# Altium schematic sheet Voltage Regulators.SchDoc
size A4; SheetNumber: 13; SheetTotal: 13; SPICEModelCacheFXTNRSHI: <root> / <DocumentId>FXTNRSHI</DocumentId> / <CacheFrame Number="0"> / <Model Name="1206_885012108012_47uf" Kind="CKT"> / <Text>******* / .subckt 1206_885012108012_47uF 1 2 / Rser 1 3 0.0027428064885 / Lser 2 4 0.0000000008 / C1 3 4 0.000047 / Rpar 3 4 1000000 / .ends 1206_885012108012_47uF</Text> / </Model> / <Model Name="1210_885012209074_22uf" Kind="CKT"> / <Text>******* / .subckt 1210_885012209074_22uF 1 2 / Rser 1 3 0.0043 / Lser 2 4 0.000000001 / C1 3 4 0.000022 / Rpar 3 4 5000000 / .ends 1210_885012209074_22uF</Text> / </Model> / </CacheFrame> / </root>
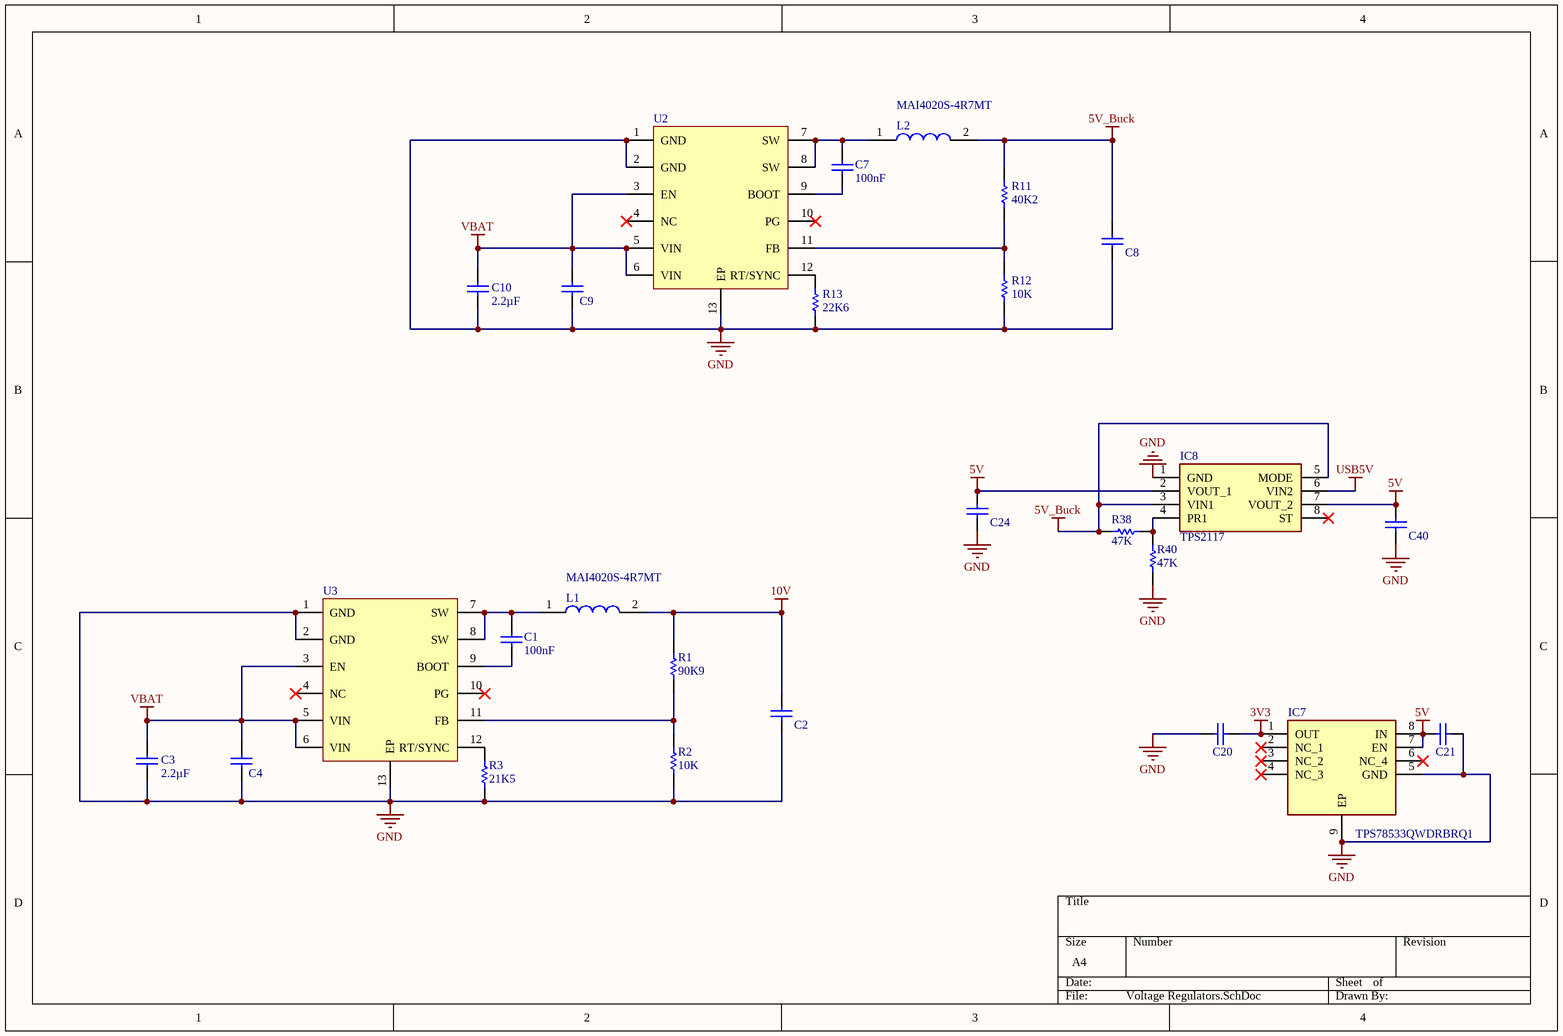
[diagram p0: Voltage Regulators.SchDoc]

## Parts
C1  100nF  [0402 cap]
C2  22µF  [WCAP-CSGP_1210_L3.2W2.5H2.5]  (value not drawn)
C3  2.2µF  [WCAP-CSGP_1206_L3.2W1.6H1.6]
C4  100nF  [WCAP-CSGP_0603_L1.6W0.8H0.8_Reflow]  (value not drawn)
C7  100nF  [0402 cap]
C8  47µF  [WCAP-CSGP_1206_L3.2W1.6H1.6]  (value not drawn)
C9  100nF  [WCAP-CSGP_0603_L1.6W0.8H0.8_Reflow]  (value not drawn)
C10  2.2µF  [WCAP-CSGP_1206_L3.2W1.6H1.6]
C20  1µF  [WCAP-CSGP_0603_L1.6W0.8H0.8_Reflow]  (value not drawn)
C21  1µF  [WCAP-CSGP_0603_L1.6W0.8H0.8_Reflow]  (value not drawn)
C24  1µF  [WCAP-CSGP_0603_L1.6W0.8H0.8_Reflow]  (value not drawn)
C40  1µF  [WCAP-CSGP_0603_L1.6W0.8H0.8_Reflow]  (value not drawn)
IC7  TPS78533QWDRBRQ1  [SON65P300X300X100-9N-D]
IC8  TPS2117  [SOTFL50P160X60-8N]
L1  MAI4020S-4R7MT  [MAI4020S-4R7MT]
L2  MAI4020S-4R7MT  [MAI4020S-4R7MT]
R1  90K9  [0402 resistor]
R2  10K  [0402 resistor]
R3  21K5  [0402 resistor]
R11  40K2  [RESC0603(1608)_N]
R12  10K  [RESC0603(1608)_N]
R13  22K6  [RESC0603(1608)_N]
R38  47K  [0402 resistor]
R40  47K  [0402 resistor]
U2  2.5A Step Down QFN synchronous  [LMR38025]  (value not drawn)
U3  2.5A Step Down QFN synchronous  [LMR38025]  (value not drawn)

## Nets
3V3: C20.2 IC7.1(OUT)
5V: C21.1 C24.2 C40.2 IC7.7(EN) IC7.8(IN) IC8.2(VOUT_1) IC8.7(VOUT_2)
5V_Buck: C8.2 IC8.3(VIN1) IC8.5(MODE) L2.2 R11.2 R38.1
10V: C2.2 L1.2 R1.2
GND: C2.1 C3.1 C4.1 C8.1 C9.1 C10.1 C20.1 C21.2 C24.1 C40.1 IC7.5(GND) IC7.9(EP) IC8.1(GND) R2.1 R3.1 R12.1 R13.1 R40.1 U2.1(GND) U2.2(GND) U2.13(EP) U3.1(GND) U3.2(GND) U3.13(EP)
USB5V: IC8.6(VIN2)
VBAT: C3.2 C4.2 C9.2 C10.2 U2.3(EN) U2.5(VIN) U2.6(VIN) U3.3(EN) U3.5(VIN) U3.6(VIN)
NetC1_1: C1.1 U3.9(BOOT)
NetC1_2: C1.2 L1.1 U3.7(SW) U3.8(SW)
NetC7_1: C7.1 U2.9(BOOT)
NetC7_2: C7.2 L2.1 U2.7(SW) U2.8(SW)
NetIC8_4: IC8.4(PR1) R38.2 R40.2
NetR1_1: R1.1 R2.2 U3.11(FB)
NetR3_2: R3.2 U3.12(RT/SYNC)
NetR11_1: R11.1 R12.2 U2.11(FB)
NetR13_2: R13.2 U2.12(RT/SYNC)

Not connected (* = marked no-connect by the designer): IC7 2(NC_1)* 3(NC_2)* 4(NC_3)* 6(NC_4)*; IC8 8(ST)*; U2 4(NC)* 10(PG)*; U3 4(NC)* 10(PG)*

## Library data of the parts
C1 C7 = Capacitor 0402 100nF: Value: 100nF
C2 = 885012209074: WCAP-CSGP Multilayer Ceramic Chip Capacitor, General Purpose, size 1210, X7R, 22µF, 25VDC; Manufacturer: Wurth Elektronik; Case/Size Code: 1210; Capacitance Tolerance: +/10%; Dissipation Factor: 10%; Insulation Resistance: 0.005GΩ; Rated Voltage (DC): 25V; Technical Reference: X7R1210226K025DFCT10000; Manufacturer Part Number: 885012209074; Category: Multilayer Ceramic Chip Capacitors; Match Code: WCAP-CSGP; ComponentLink1Description: Website Link; ComponentLink1URL: https://www.we-online.com/redexpert/article/885012209074?ad; ComponentLink2Description: Datasheet Link; ComponentLink2URL: https://www.we-online.com/redexpert/spec/885012209074?ad; Mount: Surface Mount; Operating Temperature Max: 125°C; Operating Temperature Min: -55°C; Packaging: Tape and Reel; Length: 3.2mm; Width: 2.5mm; Height: 2.5mm; Capacitance: 22µF; Ceramic Type: X7R
C3 C10 = 885012208124: WCAP-CSGP Multilayer Ceramic Chip Capacitor, General Purpose, size 1206, X7R, 2.2µF, 100VDC; Manufacturer: Wurth Elektronik; Case/Size Code: 1206; Capacitance Tolerance: +/-10%; Dissipation Factor: 5%; Insulation Resistance: 0.05GΩ; Rated Voltage (DC): 100V; Technical Reference: X7R1206225K100DFCT10000; Manufacturer Part Number: 885012208124; Category: Multilayer Ceramic Chip Capacitors; Match Code: WCAP-CSGP; ComponentLink1Description: Website Link; ComponentLink1URL: https://www.we-online.com/redexpert/article/885012208124?ad; ComponentLink2Description: Datasheet Link; ComponentLink2URL: https://www.we-online.com/redexpert/spec/885012208124?ad; Mount: Surface Mount; Operating Temperature Max: 125°C; Operating Temperature Min: -55°C; Packaging: Tape and Reel; Length: 3.2mm; Width: 1.6mm; Height: 1.6mm; Capacitance: 2.2µF; Ceramic Type: X7R
C4 C9 = 885012206095: WCAP-CSGP Multilayer Ceramic Chip Capacitor, General Purpose, size 0603, X7R, 100nF, 50VDC; Manufacturer: Wurth Elektronik; Case/Size Code: 0603; Capacitance Tolerance: +/-10%; Dissipation Factor: 3%; Insulation Resistance: 5GΩ; Rated Voltage (DC): 50V; Technical Reference: X7R0603104K050DFCT10000; Manufacturer Part Number: 885012206095; Category: Multilayer Ceramic Chip Capacitors; Match Code: WCAP-CSGP; ComponentLink1Description: Website Link; ComponentLink1URL: https://www.we-online.com/redexpert/article/885012206095?ad; ComponentLink2Description: Datasheet Link; ComponentLink2URL: https://www.we-online.com/redexpert/spec/885012206095?ad; Mount: Surface Mount; Operating Temperature Max: 125°C; Operating Temperature Min: -55°C; Packaging: Tape and Reel; Length: 1.6mm; Width: 0.8mm; Height: 0.8mm; Capacitance: 100nF; Ceramic Type: X7R
C8 = 885012108012: WCAP-CSGP Multilayer Ceramic Chip Capacitor, General Purpose, size 1206, X5R, 47µF, 10VDC; Manufacturer: Wurth Elektronik; Case/Size Code: 1206; Capacitance Tolerance: +/-20%; Dissipation Factor: 10%; Insulation Resistance: 0.002GΩ; Rated Voltage (DC): 10V; Technical Reference: X5R1206476M010DFCT10000; Manufacturer Part Number: 885012108012; Category: Multilayer Ceramic Chip Capacitors; Match Code: WCAP-CSGP; ComponentLink1Description: Website Link; ComponentLink1URL: https://www.we-online.com/redexpert/article/885012108012?ad; ComponentLink2Description: Datasheet Link; ComponentLink2URL: https://www.we-online.com/redexpert/spec/885012108012?ad; Mount: Surface Mount; Operating Temperature Max: 85°C; Operating Temperature Min: -55°C; Packaging: Tape and Reel; Length: 3.2mm; Width: 1.6mm; Height: 1.6mm; Capacitance: 47µF; Ceramic Type: X5R
C20 C21 = 885012206026: WCAP-CSGP Multilayer Ceramic Chip Capacitor, General Purpose, size 0603, X7R, 1µF, 10VDC; Manufacturer: Wurth Elektronik; Case/Size Code: 0603; Capacitance Tolerance: +/-10%; Dissipation Factor: 10%; Insulation Resistance: 0.1GΩ; Rated Voltage (DC): 10V; Technical Reference: X7R0603105K010DFCT10000; ComponentLink1Description: Website Link; ComponentLink1URL: https://www.we-online.com/redexpert/article/885012206026?ad; ComponentLink2Description: Datasheet Link; ComponentLink2URL: https://www.we-online.com/redexpert/spec/885012206026?ad; Manufacturer Part Number: 885012206026; Category: Multilayer Ceramic Chip Capacitors; Match Code: WCAP-CSGP; Mount: Surface Mount; Operating Temperature Max: 125°C; Operating Temperature Min: -55°C; Packaging: Tape and Reel; Length: 1.6mm; Width: 0.8mm; Height: 0.8mm; Capacitance: 1µF; Ceramic Type: X7R
C24 C40 = 885012106017: WCAP-CSGP Multilayer Ceramic Chip Capacitor, General Purpose, size 0603, X5R, 1µF, 16VDC; Manufacturer: Wurth Elektronik; Case/Size Code: 0603; Capacitance Tolerance: +/-20%; Dissipation Factor: 10%; Insulation Resistance: 0.1GΩ; Rated Voltage (DC): 16V; Technical Reference: X5R0603105M016DFCT10000; ComponentLink1Description: Website Link; ComponentLink1URL: https://www.we-online.com/redexpert/article/885012106017?ad; ComponentLink2Description: Datasheet Link; ComponentLink2URL: https://www.we-online.com/redexpert/spec/885012106017?ad; Manufacturer Part Number: 885012106017; Category: Multilayer Ceramic Chip Capacitors; Match Code: WCAP-CSGP; Mount: Surface Mount; Operating Temperature Max: 85°C; Operating Temperature Min: -55°C; Packaging: Tape and Reel; Length: 1.6mm; Width: 0.8mm; Height: 0.8mm; Capacitance: 1µF; Ceramic Type: X5R
IC7 = TPS78533QWDRBRQ1: Integrated Circuit; Manufacturer_Name: Texas Instruments; Datasheet Link: https://www.arrow.com/en/products/tps78533qwdrbrq1/texas-instruments?region=nac; Height: 1mm; Manufacturer_Part_Number: TPS78533QWDRBRQ1; Mouser Part Number: 595-TPS78533QWDRBRQ1; Mouser Price/Stock: https://www.mouser.co.uk/ProductDetail/Texas-Instruments/TPS78533QWDRBRQ1?qs=iLbezkQI%252BsiNbdqh2Ko9GQ%3D%3D; Arrow Part Number: TPS78533QWDRBRQ1; Arrow Price/Stock: https://www.arrow.com/en/products/tps78533qwdrbrq1/texas-instruments?region=nac
IC8 = TPS2116DRLR: Integrated Circuit; Manufacturer_Name: Texas Instruments; Datasheet Link: https://www.ti.com/lit/gpn/tps2116; Height: 0.6mm; Manufacturer_Part_Number: TPS2116DRLR; Mouser Part Number: 595-TPS2116DRLR; Mouser Price/Stock: https://www.mouser.co.uk/ProductDetail/Texas-Instruments/TPS2116DRLR?qs=aP1CjGhiNiGo3XAyXcVPaQ%3D%3D; Arrow Part Number: TPS2116DRLR; Arrow Price/Stock: https://www.arrow.com/en/products/tps2116drlr/texas-instruments?region=nac
R1-R3 R38 R40 = Resistor 0402 1K
  R1: Value: 90K9
  R2: Value: 10K
  R3: Value: 21K5
  R38 R40: Value: 47K
R11-R13 = Res 33K: Chipwiderstand, SMD, Baureihe MC, 1%; Manufacturer: Multicomp; PackageReference: 0603; OC_FARNELL: 9331506
  R11: Value: 40K2
  R12: Value: 10K
  R13: Value: 22K6
U2 U3 = LMR38025: LMR38025-Q1 SIMPLE SWITCHER® Power Converter, 4.2-V to 80-V, 2.5-A Automotive / Synchronous Buck Converter With 40-μA IQ